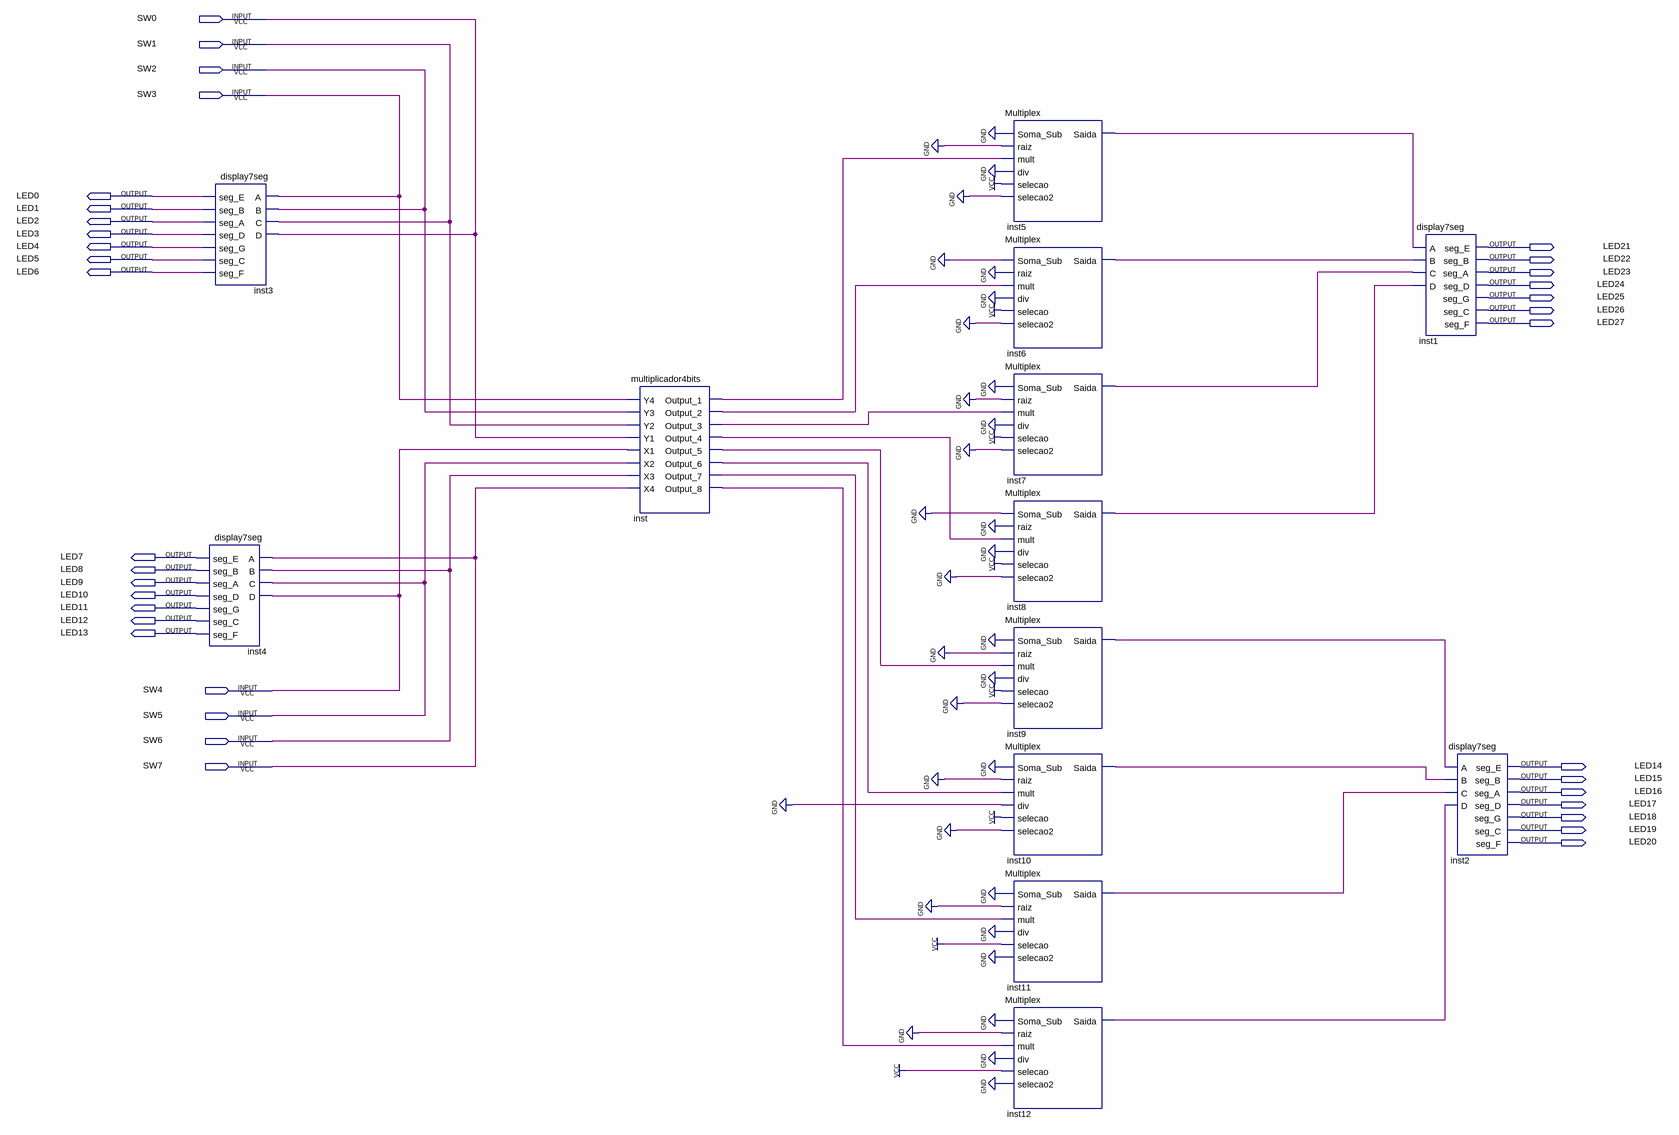
[diagram p0: schematic sheet]
// Quartus schematic multiplicador_enviar.bdf as structural Verilog: 13 symbols, 36 pins
module multiplicador_enviar (
  input  SW0,
  input  SW1,
  input  SW2,
  input  SW3,
  input  SW4,
  input  SW5,
  input  SW6,
  input  SW7,
  output LED0,
  output LED1,
  output LED2,
  output LED3,
  output LED4,
  output LED21,
  output LED5,
  output LED22,
  output LED6,
  output LED23,
  output LED24,
  output LED25,
  output LED26,
  output LED27,
  output LED7,
  output LED8,
  output LED9,
  output LED10,
  output LED11,
  output LED12,
  output LED13,
  output LED14,
  output LED15,
  output LED16,
  output LED17,
  output LED18,
  output LED19,
  output LED20
);

  wire inst5_saida, inst6_saida, inst7_saida, inst8_saida, inst9_saida, inst10_saida, inst11_saida,
       inst12_saida, inst_output_1, inst_output_2, inst_output_3, inst_output_4, inst_output_5,
       inst_output_6, inst_output_7, inst_output_8;

  display7seg inst3 (
    .A(SW3), .B(SW2), .C(SW1), .D(SW0), .seg_E(LED0), .seg_B(LED1), .seg_A(LED2), .seg_D(LED3), .seg_G(LED4),
    .seg_C(LED5), .seg_F(LED6));
  display7seg inst4 (
    .A(SW7), .B(SW6), .C(SW5), .D(SW4), .seg_E(LED7), .seg_B(LED8), .seg_A(LED9), .seg_D(LED10),
    .seg_G(LED11), .seg_C(LED12), .seg_F(LED13));
  multiplicador4bits inst (
    .Y4(SW3), .Y3(SW2), .Y2(SW1), .Y1(SW0), .X1(SW4), .X2(SW5), .X3(SW6), .X4(SW7), .Output_1(inst_output_1),
    .Output_2(inst_output_2), .Output_3(inst_output_3), .Output_4(inst_output_4), .Output_5(inst_output_5),
    .Output_6(inst_output_6), .Output_7(inst_output_7), .Output_8(inst_output_8));
  Multiplex inst5 (
    .Soma_Sub(1'b0), .raiz(1'b0), .mult(inst_output_1), .div(1'b0), .selecao(1'b1), .selecao2(1'b0),
    .Saida(inst5_saida));
  Multiplex inst6 (
    .Soma_Sub(1'b0), .raiz(1'b0), .mult(inst_output_2), .div(1'b0), .selecao(1'b1), .selecao2(1'b0),
    .Saida(inst6_saida));
  Multiplex inst7 (
    .Soma_Sub(1'b0), .raiz(1'b0), .mult(inst_output_3), .div(1'b0), .selecao(1'b1), .selecao2(1'b0),
    .Saida(inst7_saida));
  Multiplex inst8 (
    .Soma_Sub(1'b0), .raiz(1'b0), .mult(inst_output_4), .div(1'b0), .selecao(1'b1), .selecao2(1'b0),
    .Saida(inst8_saida));
  Multiplex inst9 (
    .Soma_Sub(1'b0), .raiz(1'b0), .mult(inst_output_5), .div(1'b0), .selecao(1'b1), .selecao2(1'b0),
    .Saida(inst9_saida));
  Multiplex inst10 (
    .Soma_Sub(1'b0), .raiz(1'b0), .mult(inst_output_6), .div(1'b0), .selecao(1'b1), .selecao2(1'b0),
    .Saida(inst10_saida));
  Multiplex inst11 (
    .Soma_Sub(1'b0), .raiz(1'b0), .mult(inst_output_7), .div(1'b0), .selecao(1'b1), .selecao2(1'b0),
    .Saida(inst11_saida));
  Multiplex inst12 (
    .Soma_Sub(1'b0), .raiz(1'b0), .mult(inst_output_8), .div(1'b0), .selecao(1'b1), .selecao2(1'b0),
    .Saida(inst12_saida));
  display7seg inst1 (
    .A(inst5_saida), .B(inst6_saida), .C(inst7_saida), .D(inst8_saida), .seg_E(LED21), .seg_B(LED22),
    .seg_A(LED23), .seg_D(LED24), .seg_G(LED25), .seg_C(LED26), .seg_F(LED27));
  display7seg inst2 (
    .A(inst9_saida), .B(inst10_saida), .C(inst11_saida), .D(inst12_saida), .seg_E(LED14), .seg_B(LED15),
    .seg_A(LED16), .seg_D(LED17), .seg_G(LED18), .seg_C(LED19), .seg_F(LED20));
endmodule
